# Altium project wifi_car.PrjPcb
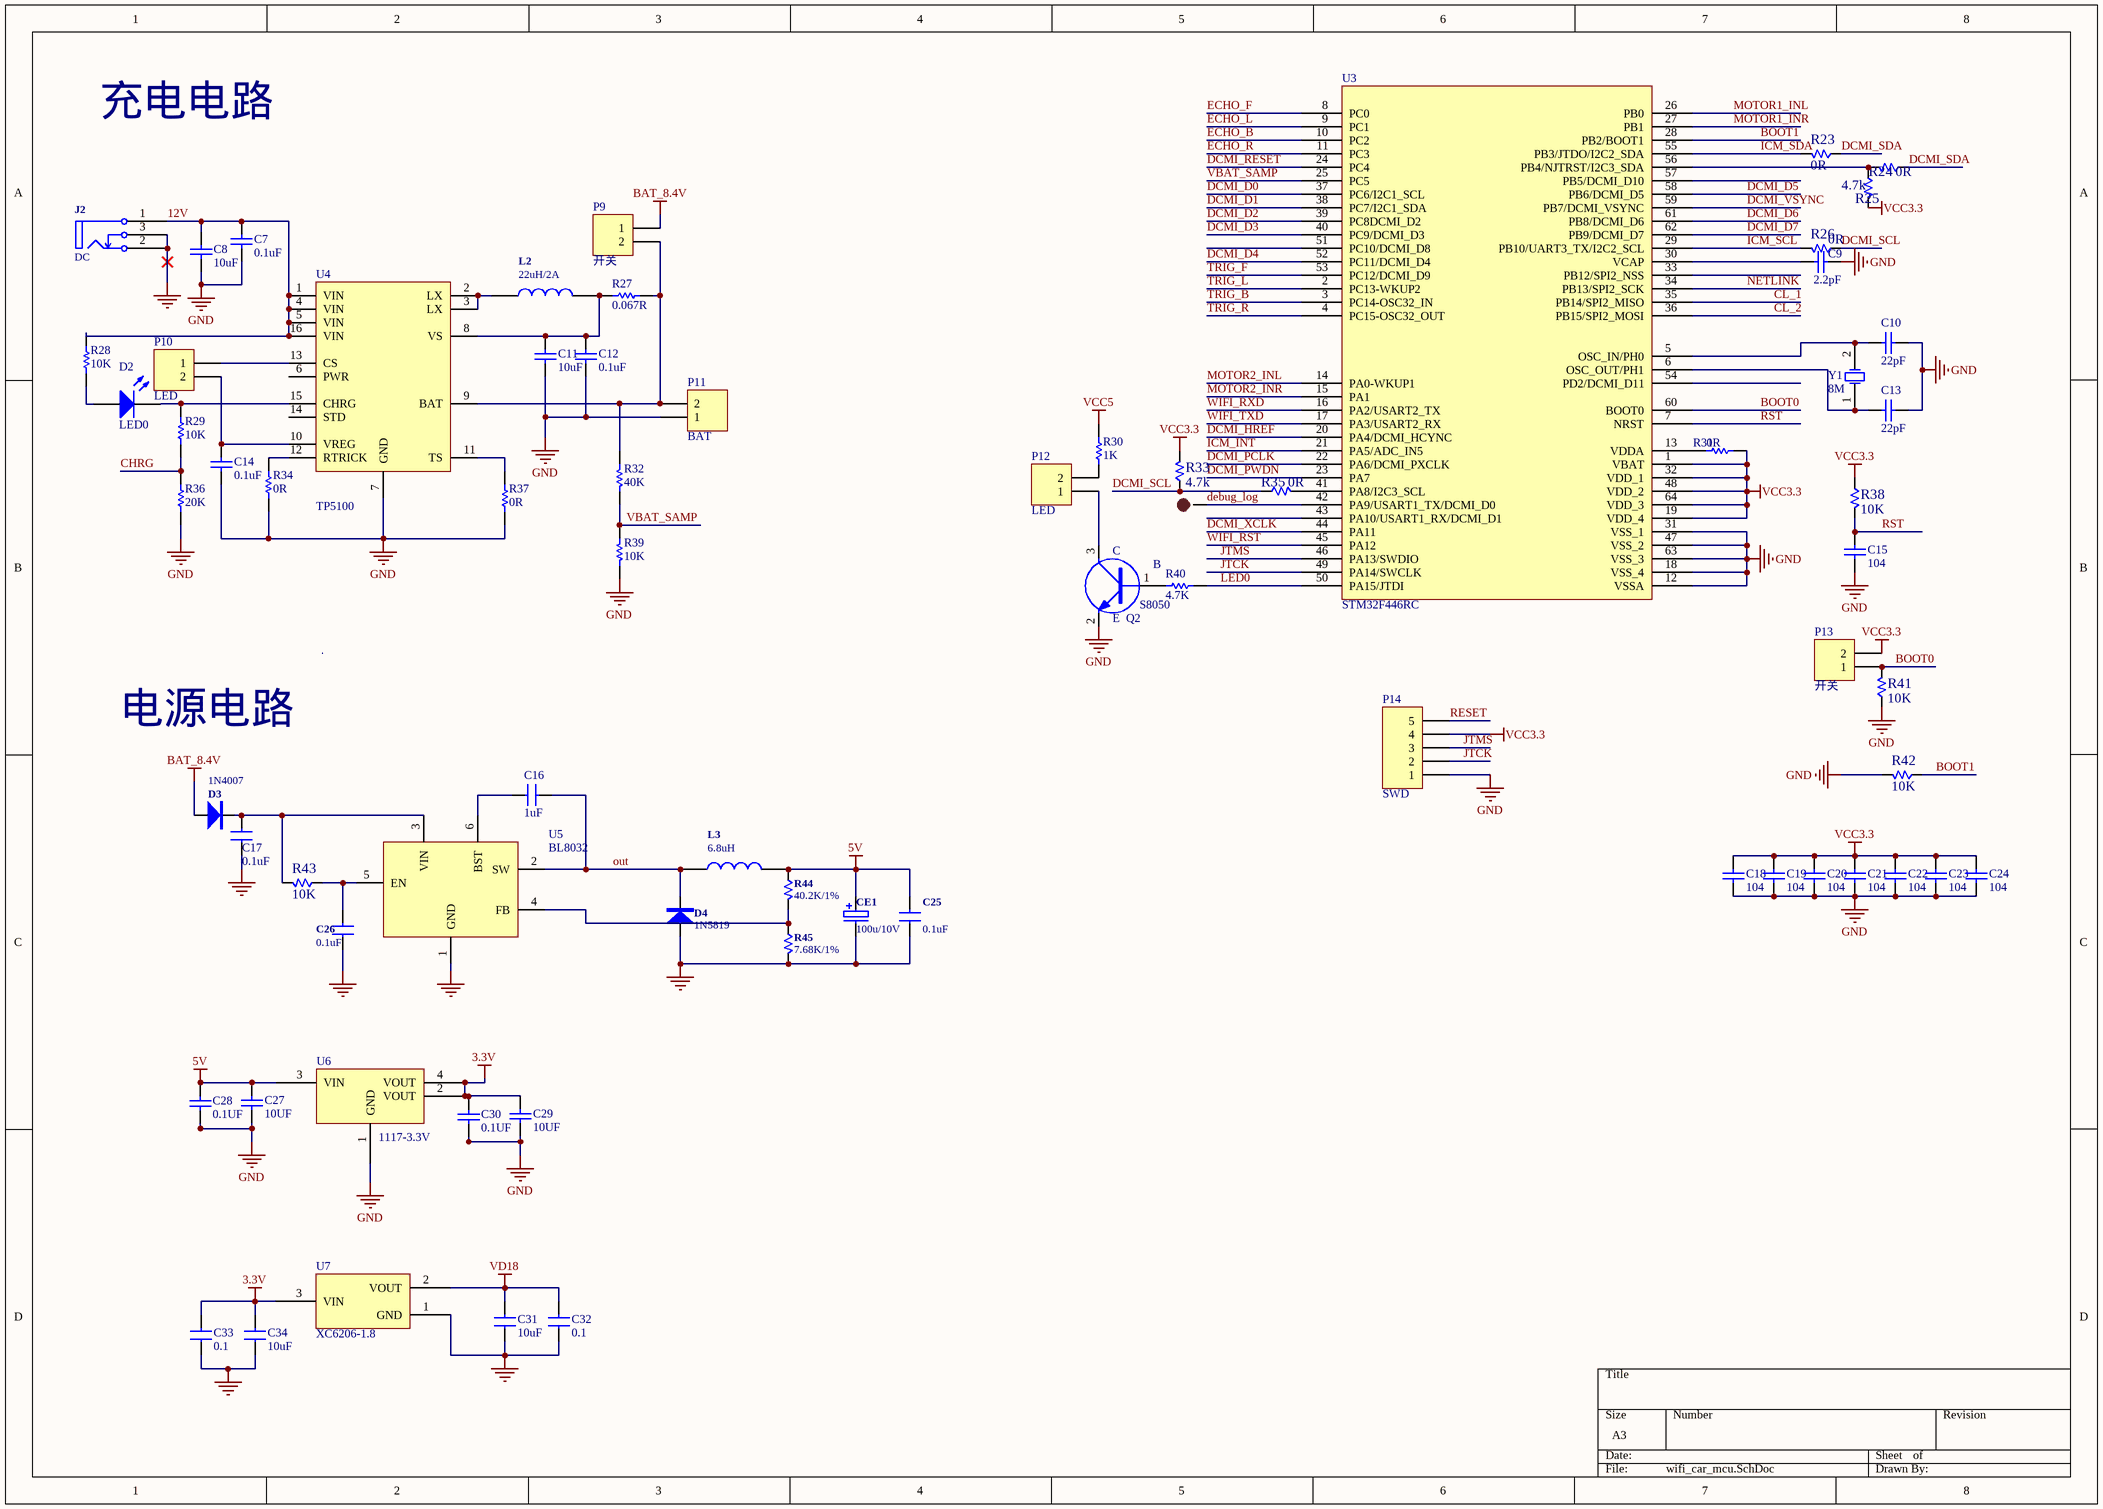
[diagram p0: wifi_car_mcu.SchDoc]
2 sheets, 114 parts. Net scope: global (net labels, ports and power ports of the same name join across sheets).
Sheets:
  wifi_car_mcu.SchDoc
  peripheral.SchDoc

## Sheet wifi_car_mcu.SchDoc
size A3

### Parts
C7  0.1uF  [0603C]
C8  10uF  [0805C]
C9  2.2pF  [0603C]
C10  22pF  [0603C]
C11  10uF  [0603C]
C12  0.1uF  [0603C]
C13  22pF  [0603C]
C14  0.1uF  [0603C]
C15  104  [0603C]
C16  1uF  [0603c]
C17  0.1uF  [C0603]
C18  104  [0603C]
C19  104  [0603C]
C20  104  [0603C]
C21  104  [0603C]
C22  104  [0603C]
C23  104  [0603C]
C24  104  [0603C]
C25  0.1uF  [C0603]
C26  0.1uF  [C0603]
C27  value 10UF  [0603C]  (hidden comment: Cap)
C28  value 0.1UF  [0603C]  (hidden comment: Cap)
C29  value 10UF  [0603C]  (hidden comment: Cap)
C30  value 0.1UF  [0603C]  (hidden comment: Cap)
C31  10uF  [C0603]
C32  0.1  [C0603]
C33  0.1  [C0603]
C34  10uF  [C0603]
CE1  100u/10V  [C_195]
D2  LED0  [0603LED]
D3  1N4007  [DO-214AC]
D4  1N5819  [DO-214AC]
J2  DC  [dc5V]
L2  22uH/2A  [WE_PD]
L3  6.8uH  [WE_PD]
P9  开关  [SIP2]
P10  LED  [SIP2]
P11  BAT  [CON2]
P12  LED  [CON2]
P13  开关  [SIP2]
P14  SWD  [HDR1X5]
Q2  S8050  [SOT-23]
R23  0R  [R0603]
R24  0R  [R0603]
R25  4.7k  [R0603]
R26  0R  [R0603]
R27  0.067R  [1206]
R28  10K  [0603C]
R29  10K  [0603C]
R30  1K  [0603R]
R31  0R  [0603R]
R32  40K  [0603R]
R33  4.7k  [R0603]
R34  0R  [0603C]
R35  0R  [R0603]
R36  20K  [0603C]
R37  0R  [0603R]
R38  10K  [R0603]
R39  10K  [0603R]
R40  4.7K  [0603R]
R41  10K  [R0603]
R42  10K  [R0603]
R43  10K  [R0603]
R44  40.2K/1%  [R0603]
R45  7.68K/1%  [R0603]
SP+?  SPK+  [TP-1.5]  (value not drawn)
U3  STM32F446RC  [LQFP64_10X10P]
U4  TP5100  [QFN16(4*4)]
U5  BL8032  [SOT23-6]
U6  1117-3.3V  [SOT223]
U7  XC6206-1.8  [SOT23C]
Y1  8M  [XTAL1]

### Nets
3.3V: C29.1 C30.1 C33.1 C34.1 U6.2(VOUT) U6.4(VOUT) U7.3(VIN)
5V: C25.1 C27.1 C28.1 CE1.1 L3.2 R44.1 U6.3(VIN)
BAT_8.4V: D3.1(A) P9.1
GND: C7.1 C8.2 C9.1 C10.1 C11.1 C12.1 C13.1 C14.1 C15.1 C17.2 C18.1 C19.1 C20.1 C21.1 C22.1 C23.1 C24.1 C25.2 C26.2 C27.2 C28.2 C29.2 C30.2 C31.2 C32.2 C33.2 C34.2 CE1.2 D4.1(A) J2.2 J2.3 P11.1 P14.1 Q2.2(E) R34.1 R36.1 R37.1 R39.2 R41.1 R42.2 R45.2 U3.12(VSSA) U3.18(VSS_4) U3.31(VSS_1) U3.47(VSS_2) U3.63(VSS_3) U4.7(GND) U5.1(GND) U6.1(GND) U7.1(GND)
VCC3.3: C18.2 C19.2 C20.2 C21.2 C22.2 C23.2 C24.2 P13.2 P14.4 R25.2 R31.2 R33.2 R38.1 U3.1(VBAT) U3.19(VDD_4) U3.32(VDD_1) U3.48(VDD_2) U3.64(VDD_3)
VCC5: R30.1
VD18: C31.1 C32.1 U7.2(VOUT)
12V: C7.2 C8.1 J2.1 R28.2 U4.1(VIN) U4.4(VIN) U4.5(VIN) U4.16(VIN)
BOOT0: P13.1 R41.2 U3.60(BOOT0)
BOOT1: R42.1 U3.28(PB2/BOOT1)
CHRG: R29.1 R36.2
CL_1: U3.35(PB14/SPI2_MISO)
CL_2: U3.36(PB15/SPI2_MOSI)
DCMI_D0: U3.37(PC6/I2C1_SCL)
DCMI_D1: U3.38(PC7/I2C1_SDA)
DCMI_D2: U3.39(PC8DCMI_D2)
DCMI_D3: U3.40(PC9/DCMI_D3)
DCMI_D4: U3.52(PC11/DCMI_D4)
DCMI_D5: U3.58(PB6/DCMI_D5)
DCMI_D6: U3.61(PB8/DCMI_D6)
DCMI_D7: U3.62(PB9/DCMI_D7)
DCMI_HREF: U3.20(PA4/DCMI_HCYNC)
DCMI_PCLK: U3.22(PA6/DCMI_PXCLK)
DCMI_PWDN: U3.23(PA7)
DCMI_RESET: U3.24(PC4)
DCMI_SCL: R26.1 R33.1 R35.1
DCMI_SDA: R23.1 R24.1
DCMI_VSYNC: U3.59(PB7/DCMI_VSYNC)
DCMI_XCLK: U3.44(PA11)
debug_log: SP+?.1 U3.42(PA9/USART1_TX/DCMI_D0)
ECHO_B: U3.10(PC2)
ECHO_F: U3.8(PC0)
ECHO_L: U3.9(PC1)
ECHO_R: U3.11(PC3)
ICM_INT: U3.21(PA5/ADC_IN5)
ICM_SCL: R26.2 U3.29(PB10/UART3_TX/I2C2_SCL)
ICM_SDA: R23.2 U3.55(PB3/JTDO/I2C2_SDA)
JTCK: P14.2 U3.49(PA14/SWCLK)
JTMS: P14.3 U3.46(PA13/SWDIO)
LED0: R40.1 U3.50(PA15/JTDI)
MOTOR1_INL: U3.26(PB0)
MOTOR1_INR: U3.27(PB1)
MOTOR2_INL: U3.14(PA0-WKUP1)
MOTOR2_INR: U3.15(PA1)
NETLINK: U3.34(PB13/SPI2_SCK)
out: C16.2 D4.2(K) L3.1 U5.2(SW)
RESET: P14.5
RST: C15.2 R38.2 U3.7(NRST)
TRIG_B: U3.3(PC14-OSC32_IN)
TRIG_F: U3.53(PC12/DCMI_D9)
TRIG_L: U3.2(PC13-WKUP2)
TRIG_R: U3.4(PC15-OSC32_OUT)
VBAT_SAMP: R32.2 R39.1 U3.25(PC5)
WIFI_RST: U3.45(PA12)
WIFI_RXD: U3.16(PA2/USART2_TX)
WIFI_TXD: U3.17(PA3/USART2_RX)
NetC9_2: C9.2 U3.30(VCAP)
NetC10_2: C10.2 U3.5(OSC_IN/PH0) Y1.2(OSC2)
NetC11_2: C11.2 C12.2 L2.2 R27.2 U4.8(VS)
NetC13_2: C13.2 U3.6(OSC_OUT/PH1) Y1.1(OSC1)
NetC14_2: C14.2 P10.2 U4.10(VREG)
NetC16_1: C16.1 U5.6(BST)
NetC17_1: C17.1 D3.2(K) R43.2 U5.3(VIN)
NetC26_1: C26.1 R43.1 U5.5(EN)
NetD2_1: D2.1(A) R28.1
NetD2_2: D2.2(K) R29.2 U4.15(CHRG)
NetL2_1: L2.1 U4.2(LX) U4.3(LX)
NetP9_2: P9.2 P11.2 R27.1 R32.1 U4.9(BAT)
NetP10_1: P10.1 U4.13(CS)
NetP12_1: P12.1 Q2.3(C)
NetP12_2: P12.2 R30.2
NetQ2_1: Q2.1(B) R40.2
NetR24_2: R24.2 R25.1 U3.56(PB4/NJTRST/I2C3_SDA)
NetR31_1: R31.1 U3.13(VDDA)
NetR34_2: R34.2 U4.12(RTRICK)
NetR35_2: R35.2 U3.41(PA8/I2C3_SCL)
NetR37_2: R37.2 U4.11(TS)
NetR44_2: R44.2 R45.1 U5.4(FB)

Not connected (* = marked no-connect by the designer): U3 33(PB12/SPI2_NSS) 43(PA10/USART1_RX/DCMI_D1) 51(PC10/DCMI_D8) 54(PD2/DCMI_D11) 57(PB5/DCMI_D10); U4 6(PWR) 14(STD)

### Notes on the sheet
- 充电电路
- 电源电路

### Library data of the parts
C7 C11 C12 C14 = CAP: Capacitor; Value: 100pF; Published: 8-Jun-2000; Revision: July-2002: Re-released for DXP Platform.; Publisher: Altium Limited
C8 = Cap: Capacitor; Value: 4.7uF; Published: 8-Jun-2000; LatestRevisionDate: 17-Jul-2002; LatestRevisionNote: Re-released for DXP Platform.; PackageReference: RAD-0.3; Publisher: Altium Limited
C9 C10 C13 C27-C30 = Cap: Capacitor; Published: 8-Jun-2000; LatestRevisionDate: 17-Jul-2002; LatestRevisionNote: Re-released for DXP Platform.; PackageReference: RAD-0.3; Publisher: Altium Limited
  C27-C30: PackageDescription: Radial Cap, Thru-Hole; 2 Leads; 0.3 in Pin Spacing
C15 C18-C24 = Cap_1: Capacitor; Published: 8-Jun-2000; LatestRevisionDate: 17-Jul-2002; LatestRevisionNote: Re-released for DXP Platform.; PackageReference: RAD-0.3; Publisher: Altium Limited
C16 C17 C25 C26 = CAP: Capacitor; IC: *
C31-C34 = C: Capacitor; IC: *
CE1 = CE
D2 = LED0: Typical INFRARED GaAs LED; Published: 8-Jun-2000; LatestRevisionDate: 08-Jul-2005; LatestRevisionNote: Mech Layer 1 removed.; PackageReference: LED-0; Publisher: Altium Limited; PackageDescription: LED; 2 Leads
D3 D4 = D: Diode
J2 = POWERCON
L2 L3 = INDUCTOR
P9-P12 = Header 2: Header, 2-Pin; LatestRevisionDate: 17-Jul-2002; LatestRevisionNote: Re-released for DXP Platform.; Publisher: Altium Limited
P13 = Header 2_1: Header, 2-Pin; LatestRevisionDate: 17-Jul-2002; LatestRevisionNote: Re-released for DXP Platform.; Publisher: Altium Limited
P14 = Header 5: Header, 5-Pin; LatestRevisionDate: 17-Jul-2002; LatestRevisionNote: Re-released for DXP Platform.; Publisher: Altium Limited
Q2 = NPN_1
R23-R26 R33 R35 R38 R41 R42 = R_1: Resistor
R27-R29 R34 R36 R37 = Res1: Resistor; Value: 1K; Published: 8-Jun-2000; LatestRevisionDate: 17-Jul-2002; LatestRevisionNote: Re-released for DXP Platform.; PackageReference: AXIAL-0.3; Publisher: Altium Limited
R30 = Res1_4: Resistor; Published: 8-Jun-2000; LatestRevisionDate: 17-Jul-2002; LatestRevisionNote: Re-released for DXP Platform.; PackageReference: AXIAL-0.3; Publisher: Altium Limited; Value: 1K
R31 R40 = Res1_4: Resistor; Value: 1K; Published: 8-Jun-2000; LatestRevisionDate: 17-Jul-2002; LatestRevisionNote: Re-released for DXP Platform.; PackageReference: AXIAL-0.3; Publisher: Altium Limited
R32 R39 = res1: Resistor; Value: 1K; Published: 8-Jun-2000; Revision: July-2002: Re-released for DXP Platform.; Publisher: Altium Limited
R43-R45 = R: Resistor
SP+? = TEST-POINT: 测试点
U4 = TP5100: Capacitor; Value: 4.7uF; Published: 8-Jun-2000; LatestRevisionDate: 17-Jul-2002; LatestRevisionNote: Re-released for DXP Platform.; PackageReference: RAD-0.3; Publisher: Altium Limited
U5 = BL8032: Diode Bridge
U6 = 1117: LDO; Published: 8-Jun-2000; LatestRevisionDate: 17-Jul-2002; LatestRevisionNote: Re-released for DXP Platform.; PackageReference: POLAR0.8; Publisher: Altium Limited
U7 = XC6206
Y1 = XTAL: Crystal Oscillator; Y?: 32.768kHz; Published: 8-Jun-2000; LatestRevisionDate: 17-Jul-2002; LatestRevisionNote: Re-released for DXP Platform.; PackageReference: R38; Publisher: Altium Limited

## Sheet peripheral.SchDoc
size A4
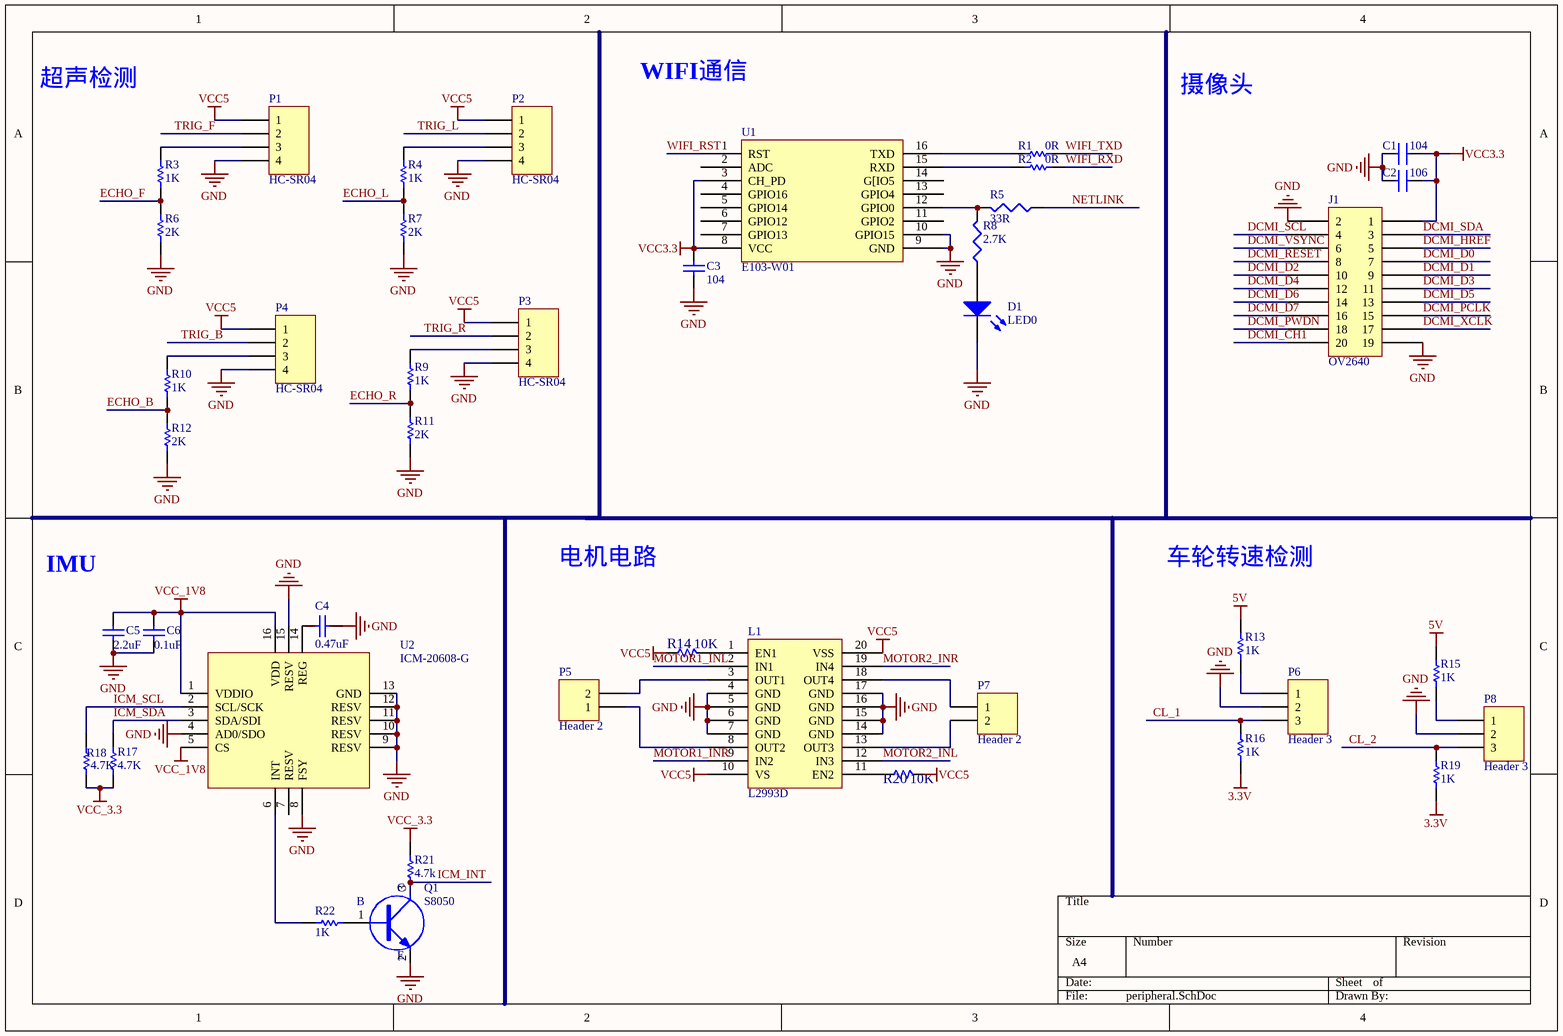
[diagram p1: peripheral.SchDoc]

### Parts
C1  104  [C0603]
C2  106  [C0603]
C3  104  [0603C]
C4  0.47uF  [0603C]
C5  2.2uF  [0603C]
C6  0.1uF  [0603C]
D1  LED0  [0603LED]
J1  OV2640
L1  L2993D
P1  HC-SR04  [HDR1X4]
P2  HC-SR04  [HDR1X4]
P3  HC-SR04  [HDR1X4]
P4  HC-SR04  [HDR1X4]
P5  Header 2  [HDR1X2]
P6  Header 3  [CON3]
P7  Header 2  [HDR1X2]
P8  Header 3  [CON3]
Q1  S8050  [SOT-23]
R1  0R  [0603R]
R2  0R  [0603R]
R3  1K  [0603C]
R4  1K  [0603C]
R5  33R  [0603R]
R6  2K  [0603C]
R7  2K  [0603C]
R8  2.7K  [0603R]
R9  1K  [0603C]
R10  1K  [0603C]
R11  2K  [0603C]
R12  2K  [0603C]
R13  1K  [0603C]
R14  10K  [R0603]
R15  1K  [0603C]
R16  1K  [0603C]
R17  4.7K  [0603C]
R18  4.7K  [0603C]
R19  1K  [0603C]
R20  10K  [R0603]
R21  4.7k  [0603C]
R22  1K  [0603C]
U1  E103-W01  [E103-W01]
U2  ICM-20608-G  [IC268G]

### Nets
3.3V: R16.1 R19.1
5V: R13.2 R15.2
GND: C1.1 C2.1 C3.1 C4.2 C5.1 C6.1 D1.2(K) J1.2 J1.19 L1.4(GND) L1.5(GND) L1.6(GND) L1.7(GND) L1.14(GND) L1.15(GND) L1.16(GND) L1.17(GND) P1.4 P2.4 P3.4 P4.4 P6.2 P8.2 Q1.2(E) R6.1 R7.1 R11.1 R12.1 U1.9(GND) U1.10(GPIO15) U2.4(AD0/SDO) U2.8(FSY) U2.9(RESV) U2.10(RESV) U2.11(RESV) U2.12(RESV) U2.13(GND) U2.15(RESV)
VCC3.3: C1.2 C2.2 C3.2 J1.1 U1.3(CH_PD) U1.8(VCC)
VCC5: L1.10(VS) L1.20(VSS) P1.1 P2.1 P3.1 P4.1 R14.1 R20.2
VCC_1V8: C5.2 C6.2 U2.1(VDDIO) U2.5(CS) U2.16(VDD)
VCC_3.3: R17.2 R18.1 R21.2
CL_1: P6.3 R16.2
CL_2: P8.3 R19.2
DCMI_CH1: J1.20
DCMI_D0: J1.7
DCMI_D1: J1.9
DCMI_D2: J1.10
DCMI_D3: J1.11
DCMI_D4: J1.12
DCMI_D5: J1.13
DCMI_D6: J1.14
DCMI_D7: J1.16
DCMI_HREF: J1.5
DCMI_PCLK: J1.15
DCMI_PWDN: J1.18
DCMI_RESET: J1.8
DCMI_SCL: J1.4
DCMI_SDA: J1.3
DCMI_VSYNC: J1.6
DCMI_XCLK: J1.17
ECHO_B: R10.1 R12.2
ECHO_F: R3.1 R6.2
ECHO_L: R4.1 R7.2
ECHO_R: R9.1 R11.2
ICM_INT: Q1.3(C) R21.1
ICM_SCL: R18.2 U2.2(SCL/SCK)
ICM_SDA: R17.1 U2.3(SDA/SDI)
MOTOR1_INL: L1.2(IN1)
MOTOR1_INR: L1.9(IN2)
MOTOR2_INL: L1.12(IN3)
MOTOR2_INR: L1.19(IN4)
NETLINK: R5.1
TRIG_B: P4.2
TRIG_F: P1.2
TRIG_L: P2.2
TRIG_R: P3.2
WIFI_RST: U1.1(RST)
WIFI_RXD: R2.2
WIFI_TXD: R1.2
NetC4_1: C4.1 U2.14(REG)
NetD1_1: D1.1(A) R8.1
NetL1_1: L1.1(EN1) R14.2
NetL1_3: L1.3(OUT1) P5.2
NetL1_8: L1.8(OUT2) P5.1
NetL1_11: L1.11(EN2) R20.1
NetL1_13: L1.13(OUT3) P7.2
NetL1_18: L1.18(OUT4) P7.1
NetP1_3: P1.3 R3.2
NetP2_3: P2.3 R4.2
NetP3_3: P3.3 R9.2
NetP4_3: P4.3 R10.2
NetP6_1: P6.1 R13.1
NetP8_1: P8.1 R15.1
NetQ1_1: Q1.1(B) R22.1
NetR1_1: R1.1 U1.16(TXD)
NetR2_1: R2.1 U1.15(RXD)
NetR5_2: R5.2 R8.2 U1.12(GPIO0)
NetR22_2: R22.2 U2.6(INT)

Not connected (* = marked no-connect by the designer): U1 2(ADC) 4(GPIO16) 5(GPIO14) 6(GPIO12) 7(GPIO13) 11(GPIO2) 13(GPIO4) 14(G[IO5); U2 7(RESV)

### Notes on the sheet
- 超声检测
- WIFI通信
- 摄像头
- IMU
- 电机电路
- 车轮转速检测

### Library data of the parts
C1 C2 = CAP_9: Capacitor; IC: *
C3-C6 = Cap_1: Capacitor; Published: 8-Jun-2000; LatestRevisionDate: 17-Jul-2002; LatestRevisionNote: Re-released for DXP Platform.; PackageReference: RAD-0.3; Publisher: Altium Limited
D1 = LED0: Typical INFRARED GaAs LED; Published: 8-Jun-2000; LatestRevisionDate: 08-Jul-2005; LatestRevisionNote: Mech Layer 1 removed.; PackageReference: LED-0; Publisher: Altium Limited; PackageDescription: LED; 2 Leads
P1-P4 = Header 4: Header, 4-Pin; LatestRevisionDate: 17-Jul-2002; LatestRevisionNote: Re-released for DXP Platform.; Publisher: Altium Limited
P5 P7 = Header 2_2: Header, 2-Pin; LatestRevisionDate: 17-Jul-2002; LatestRevisionNote: Re-released for DXP Platform.; Publisher: Altium Limited
P6 P8 = Header 3: Header, 3-Pin; LatestRevisionDate: 17-Jul-2002; LatestRevisionNote: Re-released for DXP Platform.; Publisher: Altium Limited
Q1 = NPN_1
R1 R2 = Res1_4: Resistor; Value: 1K; Published: 8-Jun-2000; LatestRevisionDate: 17-Jul-2002; LatestRevisionNote: Re-released for DXP Platform.; PackageReference: AXIAL-0.3; Publisher: Altium Limited
R3 R4 R9 R10 R13 R15 R16 R19 R22 = Res1: Resistor; Published: 8-Jun-2000; LatestRevisionDate: 17-Jul-2002; LatestRevisionNote: Re-released for DXP Platform.; PackageReference: AXIAL-0.3; Publisher: Altium Limited; Value: 1K
R5 R8 = RES1
R6 R7 R11 R12 R17 R18 R21 = Res1: Resistor; Value: 1K; Published: 8-Jun-2000; LatestRevisionDate: 17-Jul-2002; LatestRevisionNote: Re-released for DXP Platform.; PackageReference: AXIAL-0.3; Publisher: Altium Limited
R14 R20 = R_1: Resistor
U1 = E103-W01: Diode
U2 = DS-000081: Capacitor

## Nets that join several sheets
3.3V: wifi_car_mcu (7 pins), peripheral (R16.1 R19.1)
5V: wifi_car_mcu (7 pins), peripheral (R13.2 R15.2)
GND: wifi_car_mcu (50 pins), peripheral (38 pins)
VCC3.3: wifi_car_mcu (18 pins), peripheral (6 pins)
VCC5: wifi_car_mcu (R30.1), peripheral (8 pins)
CL_1: wifi_car_mcu (U3.35), peripheral (P6.3 R16.2)
CL_2: wifi_car_mcu (U3.36), peripheral (P8.3 R19.2)
DCMI_D0: wifi_car_mcu (U3.37), peripheral (J1.7)
DCMI_D1: wifi_car_mcu (U3.38), peripheral (J1.9)
DCMI_D2: wifi_car_mcu (U3.39), peripheral (J1.10)
DCMI_D3: wifi_car_mcu (U3.40), peripheral (J1.11)
DCMI_D4: wifi_car_mcu (U3.52), peripheral (J1.12)
DCMI_D5: wifi_car_mcu (U3.58), peripheral (J1.13)
DCMI_D6: wifi_car_mcu (U3.61), peripheral (J1.14)
DCMI_D7: wifi_car_mcu (U3.62), peripheral (J1.16)
DCMI_HREF: wifi_car_mcu (U3.20), peripheral (J1.5)
DCMI_PCLK: wifi_car_mcu (U3.22), peripheral (J1.15)
DCMI_PWDN: wifi_car_mcu (U3.23), peripheral (J1.18)
DCMI_RESET: wifi_car_mcu (U3.24), peripheral (J1.8)
DCMI_SCL: wifi_car_mcu (R26.1 R33.1 R35.1), peripheral (J1.4)
DCMI_SDA: wifi_car_mcu (R23.1 R24.1), peripheral (J1.3)
DCMI_VSYNC: wifi_car_mcu (U3.59), peripheral (J1.6)
DCMI_XCLK: wifi_car_mcu (U3.44), peripheral (J1.17)
ECHO_B: wifi_car_mcu (U3.10), peripheral (R10.1 R12.2)
ECHO_F: wifi_car_mcu (U3.8), peripheral (R3.1 R6.2)
ECHO_L: wifi_car_mcu (U3.9), peripheral (R4.1 R7.2)
ECHO_R: wifi_car_mcu (U3.11), peripheral (R9.1 R11.2)
ICM_INT: wifi_car_mcu (U3.21), peripheral (Q1.3 R21.1)
ICM_SCL: wifi_car_mcu (R26.2 U3.29), peripheral (R18.2 U2.2)
ICM_SDA: wifi_car_mcu (R23.2 U3.55), peripheral (R17.1 U2.3)
MOTOR1_INL: wifi_car_mcu (U3.26), peripheral (L1.2)
MOTOR1_INR: wifi_car_mcu (U3.27), peripheral (L1.9)
MOTOR2_INL: wifi_car_mcu (U3.14), peripheral (L1.12)
MOTOR2_INR: wifi_car_mcu (U3.15), peripheral (L1.19)
NETLINK: wifi_car_mcu (U3.34), peripheral (R5.1)
TRIG_B: wifi_car_mcu (U3.3), peripheral (P4.2)
TRIG_F: wifi_car_mcu (U3.53), peripheral (P1.2)
TRIG_L: wifi_car_mcu (U3.2), peripheral (P2.2)
TRIG_R: wifi_car_mcu (U3.4), peripheral (P3.2)
WIFI_RST: wifi_car_mcu (U3.45), peripheral (U1.1)
WIFI_RXD: wifi_car_mcu (U3.16), peripheral (R2.2)
WIFI_TXD: wifi_car_mcu (U3.17), peripheral (R1.2)